# EAGLE design scheme1 (EAGLE 7.1.0)
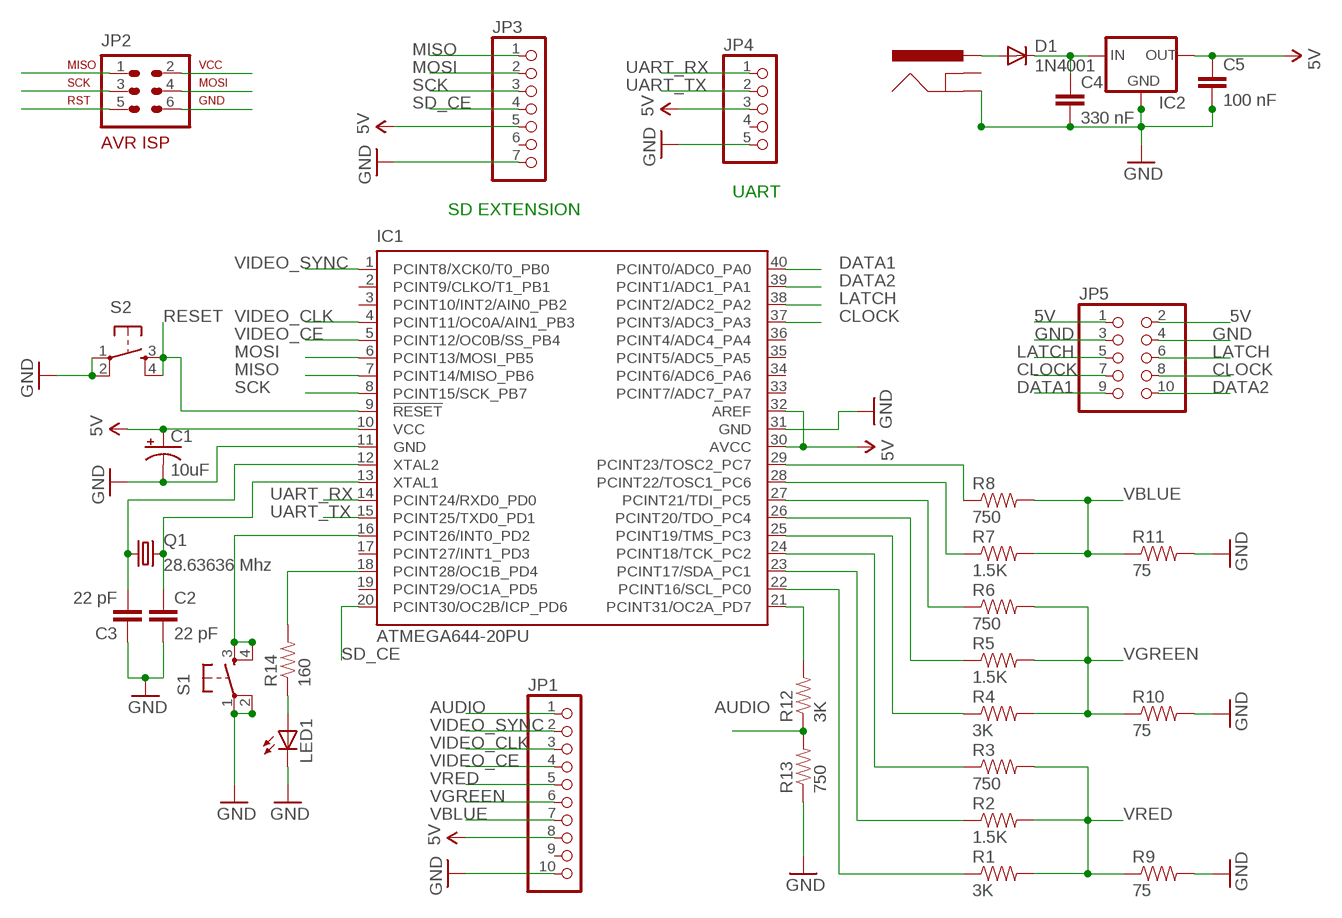
[diagram p0: schematic, sheet 1]

## Parts
C1  10uF  CAP_POLPTH2  [CPOL-RADIAL-10UF-25V]
C2  22 pF  CAPPTH  [CAP-PTH-SMALL]
C3  22 pF  CAPPTH  [CAP-PTH-SMALL]
C4  330 nF  CAPPTH  [CAP-PTH-SMALL]
C5  100 nF  CAPPTH  [CAP-PTH-SMALL]
D1  1N4001  DIODEPTH  [DIODE-1N4001]
IC1  ATMEGA644-20PU  [DIL40]
IC2  V_REG_78XXSIDE  [78XXL]
J1  POWER_JACKSLT  [POWER_JACK_SLOT]
JP1  PINHD-1X10  [1X10]
JP2  AVR-ISP-6VERT  [AVR-ISP-6]
JP3  PINHD-1X7  [1X07]
JP4  PINHD-1X5  [1X05]
JP5  PINHD-2X5  [2X05]
LED1  LED3MM  [LED3MM]
Q1  28.63636 Mhz  CRYSTALHC49US  [HC49US]
R1  3K  RESISTORPTH1  [AXIAL-0.3]
R2  1.5K  RESISTORPTH1  [AXIAL-0.3]
R3  750  RESISTORPTH1  [AXIAL-0.3]
R4  3K  RESISTORPTH1  [AXIAL-0.3]
R5  1.5K  RESISTORPTH1  [AXIAL-0.3]
R6  750  RESISTORPTH1  [AXIAL-0.3]
R7  1.5K  RESISTORPTH1  [AXIAL-0.3]
R8  750  RESISTORPTH1  [AXIAL-0.3]
R9  75  RESISTORPTH1  [AXIAL-0.3]
R10  75  RESISTORPTH1  [AXIAL-0.3]
R11  75  RESISTORPTH1  [AXIAL-0.3]
R12  3K  RESISTORPTH1  [AXIAL-0.3]
R13  750  RESISTORPTH1  [AXIAL-0.3]
R14  160  RESISTORPTH1  [AXIAL-0.3]
S1  TAC_SWITCHPTH  [TACTILE-PTH]
S2  TAC_SWITCHPTH  [TACTILE-PTH]

## Nets
5V: C1.1(+) C5.1 IC1.10(VCC) IC1.30(AVCC) IC1.32(AREF) IC2.OUT JP1.8 JP2.2 JP3.5 JP4.3 JP5.1 JP5.2
AUDIO: JP1.1 R12.P$1 R13.P$2
CLOCK: IC1.37(PCINT3/ADC3_PA3) JP5.7 JP5.8
DATA1: IC1.40(PCINT0/ADC0_PA0) JP5.9
DATA2: IC1.39(PCINT1/ADC1_PA1) JP5.10
GND: C1.2(-) C2.2 C3.1 C4.2 C5.2 IC1.11(GND) IC1.31(GND) IC2.GND J1.GND@2(GND) JP1.10 JP2.6 JP3.7 JP4.5 JP5.3 JP5.4 LED1.K(C) R9.P$2 R10.P$2 R11.P$2 R13.P$1 S1.1 S1.2 S2.1 S2.2
LATCH: IC1.38(PCINT2/ADC2_PA2) JP5.5 JP5.6
MISO: IC1.7(PCINT14/MISO_PB6) JP2.1 JP3.1
MOSI: IC1.6(PCINT13/MOSI_PB5) JP2.4 JP3.2
N$1: IC1.22(PCINT16/SCL_PC0) R1.P$1
N$2: IC1.23(PCINT17/SDA_PC1) R2.P$1
N$3: IC1.24(PCINT18/TCK_PC2) R3.P$1
N$4: C3.2 IC1.12(XTAL2) Q1.1
N$5: C2.1 IC1.13(XTAL1) Q1.2
N$6: IC1.25(PCINT19/TMS_PC3) R4.P$1
N$7: IC1.26(PCINT20/TDO_PC4) R5.P$1
N$8: IC1.27(PCINT21/TDI_PC5) R6.P$1
N$9: IC1.28(PCINT22/TOSC1_PC6) R7.P$1
N$10: IC1.29(PCINT23/TOSC2_PC7) R8.P$1
N$11: IC1.21(PCINT31/OC2A_PD7) R12.P$2
N$12: IC1.18(PCINT28/OC1B_PD4) R14.P$2
N$13: LED1.A R14.P$1
N$14: IC1.16(PCINT26/INT0_PD2) S1.3 S1.4
N$15: D1.A J1.PWR
N$16: C4.1 D1.C IC2.IN
RESET: IC1.9(!RESET) JP2.5 S2.3 S2.4
SCK: IC1.8(PCINT15/SCK_PB7) JP2.3 JP3.3
SD_CE: IC1.20(PCINT30/OC2B/ICP_PD6) JP3.4
UART_RX: IC1.14(PCINT24/RXD0_PD0) JP4.1
UART_TX: IC1.15(PCINT25/TXD0_PD1) JP4.2
VBLUE: JP1.7 R7.P$2 R8.P$2 R11.P$1
VGREEN: JP1.6 R4.P$2 R5.P$2 R6.P$2 R10.P$1
VIDEO_CE: IC1.5(PCINT12/OC0B/SS_PB4) JP1.4
VIDEO_CLK: IC1.4(PCINT11/OC0A/AIN1_PB3) JP1.3
VIDEO_SYNC: IC1.1(PCINT8/XCK0/T0_PB0) JP1.2
VRED: JP1.5 R1.P$2 R2.P$2 R3.P$2 R9.P$1
Unconnected: IC1.2(PCINT9/CLKO/T1_PB1) IC1.3(PCINT10/INT2/AIN0_PB2) IC1.17(PCINT27/INT1_PD3) IC1.19(PCINT29/OC1A_PD5) IC1.33(PCINT7/ADC7_PA7) IC1.34(PCINT6/ADC6_PA6) IC1.35(PCINT5/ADC5_PA5) IC1.36(PCINT4/ADC4_PA4) J1.GND@1(GNDBREAK) JP1.9 JP3.6 JP4.4

## Notes on the sheet
- UART
- SD EXTENSION

## Library data of the parts
C1 = SparkFun:CAP_POL: Capacitor Polarized These are standard SMD and PTH capacitors. Normally 10uF, 47uF, and 100uF in electrolytic and tantalum varieties. Always verify the external diameter of the through hole cap, it varies with capacity, voltage, and manufacturer. The EIA devices should be standard.
C2-C5 = SparkFun:CAP: Capacitor Standard 0603 ceramic capacitor, and 0.1" leaded capacitor.
D1 = SparkFun:DIODE: Diode These are standard reverse protection diodes and small signal diodes. SMA package can handle up to about 1A. SOD-323 can handle about 200mA. What the SOD-323 package when ordering, there are some mfgs out there that are 5-pin packages.
IC1 = atmel:ATMEGA644-*PU: 8-bit Microcontroller with 64K Bytes In-System Programmable Flash Auto generated by make-symbol-device-package-bsdl.ulp Rev. 34 Source: http://www.atmel.com/dyn/resources/prod_documents/doc2593.pdf; MPN: ATMEGA644-20PU; OC_FARNELL: 1288340; OC_NEWARK: 23M5060
IC2 = SparkFun:V_REG_78XX: Voltage Regulator Standard 7805 5V regulator. IGO (Input Ground Output). Spark Fun Electronics SKU : COM-00107
J1 = SparkFun:POWER_JACK: Power Jack This is the standard 5.5mm barrel jack for power. The PTH is the most common, proven, reliable, footprint. All others are experimental. The Slot footprint only works if the mill layer is transmitted to the PCB fab house so be warned. Spark Fun Electronics SKU : PRT-00119. Mating wall wart : TOL-00298 (and others)
JP1 = pinhead:PINHD-1X10: PIN HEADER
JP2 = avr-7:AVR-ISP-6: AVR ISP-6 Serial Programming Header
JP3 = pinhead:PINHD-1X7: PIN HEADER
JP4 = pinhead:PINHD-1X5: PIN HEADER
JP5 = pinhead:PINHD-2X5: PIN HEADER
LED1 = SparkFun:LED: LEDs Standard schematic elements and footprints for 5mm, 3mm, 1206, and 0603 sized LEDs. 5mm - Spark Fun Electronics SKU : COM-00529 (and others)
Q1 = SparkFun:CRYSTAL: Crystals Various standard crystals. Proven footprints. Spark Fun Electronics SKU : COM-00534
R1-R14 = SparkFun:RESISTOR: Resistor Basic schematic elements and footprints for 0603, 1206, and PTH 1/10th watt (small) resistors.
S1 S2 = SparkFun:TAC_SWITCH: Momentary Switch Button commonly used for reset or general input. Spark Fun Electronics SKU : COM-00097

## Board
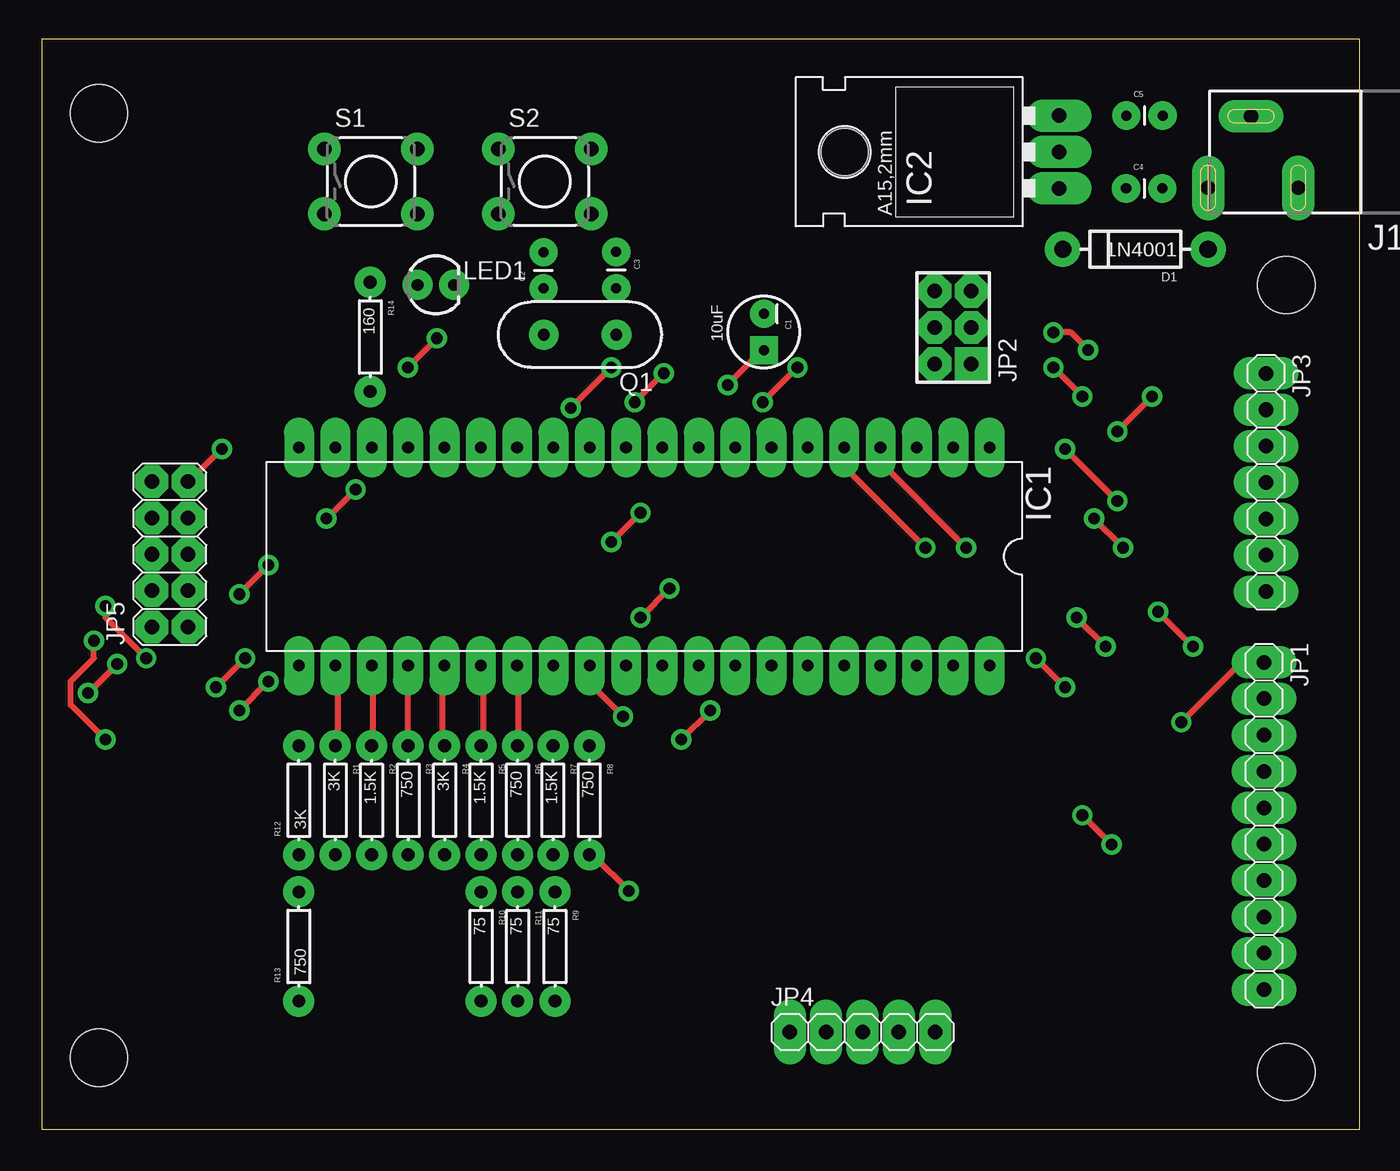
[diagram p1: board, top side]
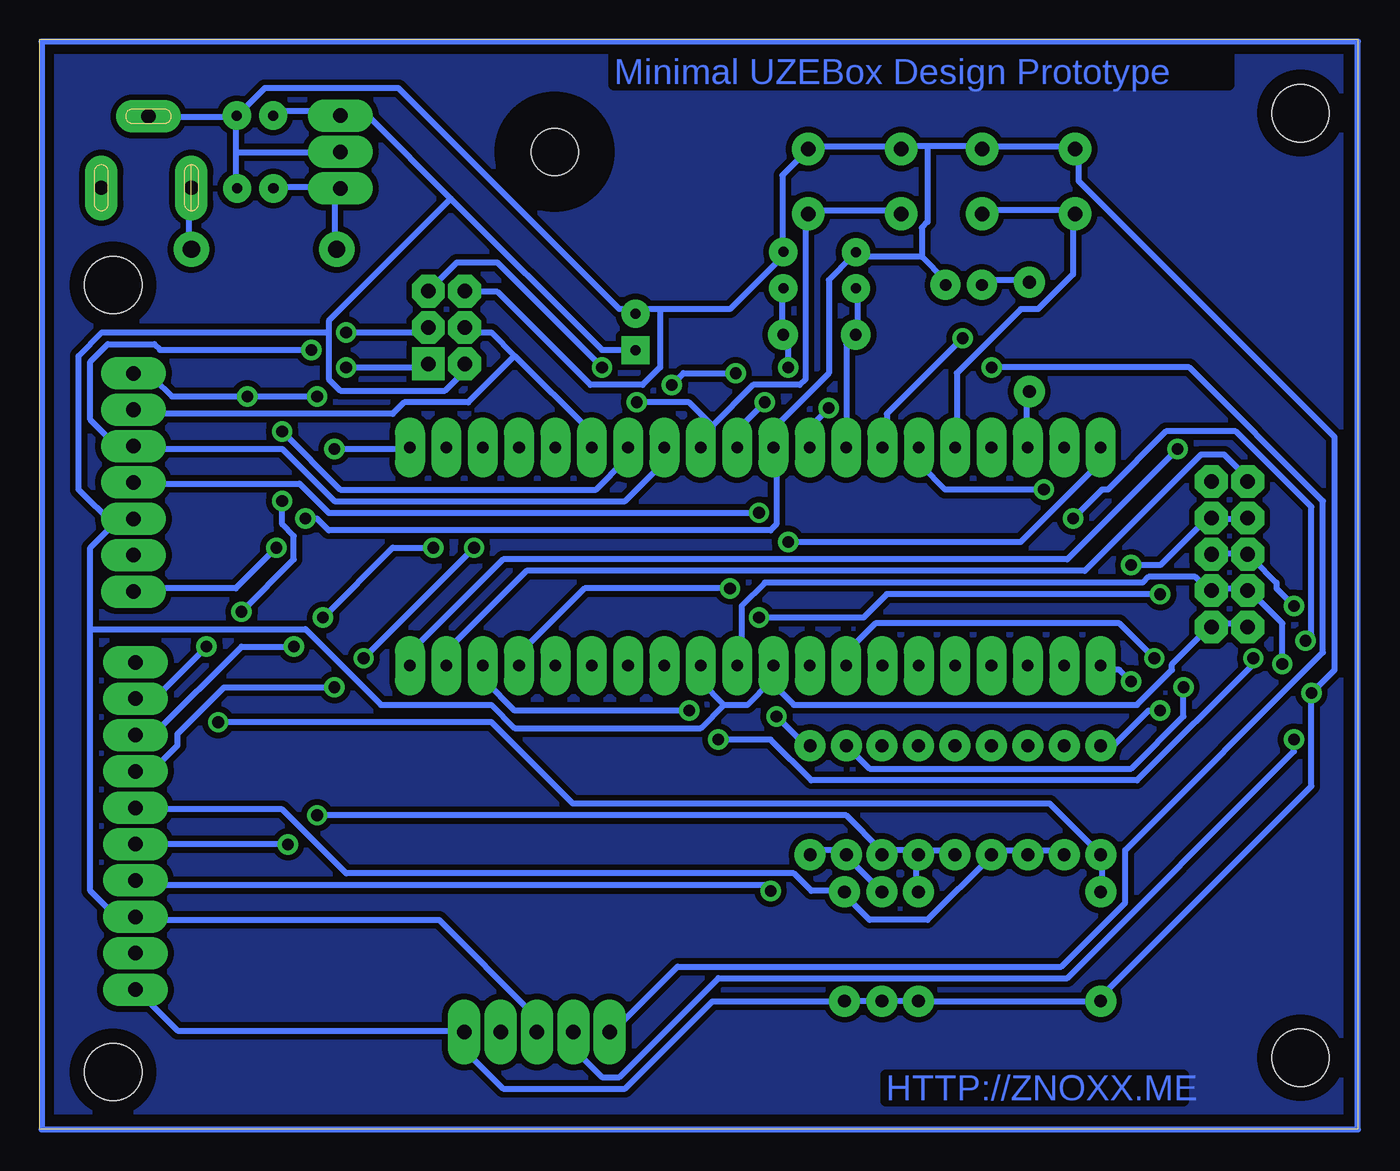
[diagram p2: board, bottom side, seen from below]

Size 92.12 x 76.16 mm. Coordinates in mm from the lower left corner, seen from the top.
Outline: 0,0 92.12,0 92.12,76.16 0,76.16 0,0
Copper layers (1*16): Top 0.035mm / dielectric 1.5mm / Bottom 0.035mm
Design rules "default *": minimum track width 16mil, minimum drill 32mil, track to track 16mil, track to pad 12mil, pad to pad 12mil, via to via 12mil, smd to smd 8mil, copper to edge 40mil, drill to drill 40mil, minimum pad ring 25mil, minimum via ring 12mil, stop-mask expansion 4mil, vias tented up to drill 0mil, thermal gap 10mil
Holes 4 mm at 4,5 4,71 87,59 87,4

### Footprints (pad centres in the part's own frame; a part is rotated, then mirrored left to right if it is on the bottom)
CPOL-RADIAL-10UF-25V = drill 0.7 square: 1 1.27,0 | drill 0.7: 2 -1.27,0
CAP-PTH-SMALL = drill 0.7: 1 0,0; 2 2.54,0
DIODE-1N4001 = drill 1.2: A -5.08,0; C 5.08,0
DIL40 = drill 0.813 long: 1 -24.13,-7.62; 2 -21.59,-7.62; 3 -19.05,-7.62; 4 -16.51,-7.62; 5 -13.97,-7.62; 6 -11.43,-7.62; 7 -8.89,-7.62; 8 -6.35,-7.62; 9 -3.81,-7.62; 10 -1.27,-7.62; 11 1.27,-7.62; 12 3.81,-7.62; 13 6.35,-7.62; 14 8.89,-7.62; 15 11.43,-7.62; 16 13.97,-7.62; 17 16.51,-7.62; 18 19.05,-7.62; 19 21.59,-7.62; 20 24.13,-7.62; 21 24.13,7.62; 22 21.59,7.62; 23 19.05,7.62; 24 16.51,7.62; 25 13.97,7.62; 26 11.43,7.62; 27 8.89,7.62; 28 6.35,7.62; 29 3.81,7.62; 30 1.27,7.62; 31 -1.27,7.62; 32 -3.81,7.62; 33 -6.35,7.62; 34 -8.89,7.62; 35 -11.43,7.62; 36 -13.97,7.62; 37 -16.51,7.62; 38 -19.05,7.62; 39 -21.59,7.62; 40 -24.13,7.62
78XXL = drill 1.016 long: GND 0,-3.81; IN -2.54,-3.81; OUT 2.54,-3.81 | hole 3.302: 0,11.176
POWER_JACK_SLOT = drill 1 pad 2 long: GND@1 2.58,7.5; GND@2 7.58,10.8; PWR 2.58,13.8
1X10 = drill 1.016 long: 1 -11.43,0; 2 -8.89,0; 3 -6.35,0; 4 -3.81,0; 5 -1.27,0; 6 1.27,0; 7 3.81,0; 8 6.35,0; 9 8.89,0; 10 11.43,0
AVR-ISP-6 = drill 1.016 square: 1 -2.54,-1.27 | drill 1.016 octagon: 2 -2.54,1.27; 3 0,-1.27; 4 0,1.27; 5 2.54,-1.27; 6 2.54,1.27
1X07 = drill 1.016 long: 1 -7.62,0; 2 -5.08,0; 3 -2.54,0; 4 0,0; 5 2.54,0; 6 5.08,0; 7 7.62,0
1X05 = drill 1.016 long: 1 -5.08,0; 2 -2.54,0; 3 0,0; 4 2.54,0; 5 5.08,0
2X05 = drill 1.016 octagon: 1 -5.08,-1.27; 2 -5.08,1.27; 3 -2.54,-1.27; 4 -2.54,1.27; 5 0,-1.27; 6 0,1.27; 7 2.54,-1.27; 8 2.54,1.27; 9 5.08,-1.27; 10 5.08,1.27
LED3MM = drill 0.813: A -1.27,0; K 1.27,0
HC49US = drill 0.813: 1 -2.54,0; 2 2.54,0
AXIAL-0.3 = drill 0.9: P$1 -3.81,0; P$2 3.81,0
TACTILE-PTH = drill 1.016: 1 -3.251,2.261; 2 3.251,2.261; 3 -3.251,-2.261; 4 3.251,-2.261

### Placement (x,y rotation side)
C1  50.48,55.71 270 top
C2  35.08,58.75 90 top
C3  40.16,61.3 270 top
C4  75.8,65.74 0 top
C5  75.81,70.83 0 top
D1  76.45,61.5 180 top
IC1  42.12,40.02 180 top
IC2  67.31,68.29 90 top
J1  95.33,63.2 90 top
JP1  85.45,21.2 270 top
JP2  63.7,56.03 90 top
JP3  85.59,45.2 270 top
JP4  57.38,6.8 0 top
JP5  8.97,40.18 90 top
LED1  27.55,59 0 top
Q1  37.64,55.52 180 top
R1  20.53,23 270 top
R2  23.07,23 270 top
R3  25.63,23 270 top
R4  28.18,23 270 top
R5  30.72,23 270 top
R6  33.27,23 270 top
R7  35.74,23 270 top
R8  38.28,23 270 top
R9  35.88,12.78 270 top
R10  30.72,12.78 270 top
R11  33.27,12.78 270 top
R12  17.98,23 90 top
R13  17.98,12.78 90 top
R14  22.97,55.37 270 top
S1  23.01,66.23 0 top
S2  35.17,66.23 0 top

### Tracks (layer width: path | path; a pad name or v marks a point on that pad's centre or on a via)
5V  (via drill 0.81)
  Top 0.406: v43.49,52.83 v41.45,50.8 | v47.96,52.02 50.39,54.46 C1.1
  Bottom 0.406: 63.4,65.02 69.09,70.71 71.12,70.71 IC2.OUT 71.53,71.12 75.59,71.12 C5.1 | 63.4,65.02 52.83,54.46 50.8,54.46 C1.1 | v41.45,50.8 43.08,49.17 43.08,47.95 IC1.10 | v43.49,52.83 47.14,52.83 v47.96,52.02 | 71.93,55.68 71.93,56.49 63.4,65.02 | 71.93,55.68 71.93,52.43 71.12,51.61 63.81,51.61 62.59,52.83 62.59,53.24 JP2.2 | JP5.2 7.72,35.36 10.16,35.36 JP5.1 10.57,34.95 13.01,32.51 13.01,32.11 15.44,29.67 39.42,29.67 41.05,31.29 | 41.05,31.29 41.05,32.11 IC1.30 41.05,31.29 | 41.05,31.29 42.67,29.67 44.3,29.67 | 44.3,29.67 45.92,31.29 45.92,32.11 IC1.32 | JP4.3 57.71,6.91 57.71,8.13 64.21,14.63 85.34,14.63 JP1.8 85.75,15.04 86.97,15.04 88.6,16.66 88.6,34.95 | 86.97,42.27 85.75,42.27 JP3.5 86.97,42.27 | 86.97,42.27 88.6,40.64 88.6,34.95 | 44.3,29.67 45.92,28.04 58.93,28.04 60.55,29.67 68.28,29.67 73.56,34.95 88.6,34.95 | 71.93,55.68 87.78,55.68 89.41,54.05 89.41,44.7 86.97,42.27
AUDIO  (via drill 0.81)
  Top 0.406: v79.65,28.45 83.72,32.51 85.34,32.51 JP1.1
  Bottom 0.406: R13.P$2 17.88,16.66 17.88,19.1 R12.P$1 18.29,19.51 21.54,22.76 54.86,22.76 60.55,28.45 v79.65,28.45
CLOCK  (via drill 0.81)
  Top 0.406: v41.86,35.76 v43.89,37.8 | v15.85,39.42 v13.82,37.39
  Bottom 0.406: v43.89,37.8 54.05,37.8 58.52,33.33 58.52,32.51 IC1.37 | v41.86,35.76 34.54,35.76 32.92,37.39 v13.82,37.39 | v15.85,39.42 13.82,39.42 10.57,42.67 JP5.7 10.16,42.67 7.72,42.67 JP5.8
DATA1  (via drill 0.81)
  Top 0.406: v12.6,47.55 10.57,45.52 JP5.9
  Bottom 0.406: v12.6,47.55 20.32,39.83 59.74,39.83 66.24,33.33 66.24,32.51 IC1.40
DATA2
  Bottom 0.406: IC1.39 63.4,32.51 63.4,33.73 58.12,39.01 19.1,39.01 10.97,47.14 9.35,47.14 7.72,45.52 JP5.10
GND  (via drill 0.81)
  Top 0.406: v73.56,42.67 v75.59,40.64 | v3.25,30.48 v5.28,32.51
  Bottom 0.406: 30.48,60.96 34.95,60.96 C2.2 35.36,60.96 36.98,59.33 36.98,52.83 40.64,49.17 40.64,47.95 IC1.11 40.64,47.55 40.64,42.27 41.05,41.86 71.93,41.86 72.75,42.67 v73.56,42.67 | 30.48,60.96 28.85,59.33 LED1.K | v75.59,40.64 78.44,37.8 85.34,37.8 JP3.7 | 78.44,70.71 78.44,68.28 | 78.44,68.28 78.44,65.84 C4.2 | 78.44,70.71 84.13,70.71 J1.GND@2 | 78.44,70.71 C5.2 78.03,71.12 76.4,72.75 67.06,72.75 51.61,57.3 50.8,57.3 C1.2 50.39,57.3 48.77,57.3 | 78.44,68.28 71.53,68.28 IC2.GND | 30.07,68.68 26.42,68.68 S1.2 26.01,68.68 19.91,68.68 S1.1 19.51,68.28 19.51,66.24 1.63,48.36 1.63,32.11 v3.25,30.48 3.25,23.98 17.88,9.35 R13.P$1 18.29,8.94 30.48,8.94 R10.P$2 30.89,8.94 32.92,8.94 R11.P$2 33.33,8.94 35.76,8.94 R9.P$2 36.17,8.94 45.11,8.94 51.21,2.85 59.74,2.85 62.18,5.28 62.18,6.5 JP4.5 62.59,6.91 82.5,6.91 85.34,9.75 JP1.10 | 30.07,68.68 31.7,68.68 S2.1 32.11,68.68 38.2,68.68 S2.2 38.61,68.28 40.23,66.65 40.23,61.37 C3.1 40.23,60.96 43.89,57.3 48.77,57.3 | 48.77,57.3 48.77,53.24 49.99,52.02 53.65,52.02 60.15,58.52 62.18,58.52 JP2.6 | 30.48,60.96 30.48,62.99 30.07,63.4 30.07,68.68 | IC1.31 43.08,32.51 43.08,36.58 41.45,38.2 15.04,38.2 14.63,38.61 11.38,38.61 10.57,37.8 JP5.3 10.16,37.8 7.72,37.8 JP5.4 7.32,37.39 5.28,35.36 v5.28,32.51
LATCH  (via drill 0.81)
  Top 0.406: v44.7,27.23 v46.74,29.26 | v7.32,32.92 4.47,35.76 v4.47,36.58
  Bottom 0.406: v46.74,29.26 58.93,29.26 60.96,31.29 60.96,32.11 IC1.38 | v44.7,27.23 41.05,27.23 38.2,24.38 15.44,24.38 7.32,32.51 v7.32,32.92 | v4.47,36.58 5.69,37.8 5.69,38.2 7.32,39.83 JP5.6 7.72,40.23 10.16,40.23 JP5.5
MISO  (via drill 0.81)
  Top 0.406: v77.62,51.21 v75.18,48.77 | v72.75,51.21 v70.71,53.24
  Bottom 0.406: v75.18,48.77 71.12,44.7 53.24,44.7 51.21,46.74 51.21,47.55 IC1.7 | JP3.1 85.34,52.43 84.13,52.43 82.91,51.21 v77.62,51.21 v72.75,51.21 | v70.71,53.24 65.02,53.24 JP2.1
MOSI
  Bottom 0.406: 58.93,54.05 60.55,55.68 62.18,55.68 JP2.4 | 58.93,54.05 53.65,48.77 53.65,47.95 IC1.6 | 58.93,54.05 62.18,50.8 66.65,50.8 67.46,49.99 85.34,49.99 JP3.2
N$1
  Top 0.406: IC1.22 20.73,32.11 20.73,26.82 R1.P$1
N$2
  Top 0.406: IC1.23 23.17,32.11 23.17,26.82 R2.P$1
N$3
  Top 0.406: IC1.24 25.6,32.11 25.6,26.82 R3.P$1
N$4  (via drill 0.81)
  Top 0.406: v39.83,53.24 v36.98,50.39
  Bottom 0.406: C3.2 40.23,58.52 40.23,55.68 Q1.1 39.83,55.27 v39.83,53.24 | v36.98,50.39 38.2,49.17 38.2,47.95 IC1.12
N$5
  Bottom 0.406: C2.1 34.95,58.52 34.95,55.68 Q1.2 35.36,55.27 35.76,54.86 35.76,47.95 IC1.13
N$6
  Top 0.406: IC1.25 28.04,32.11 28.04,26.82 R4.P$1
N$7
  Top 0.406: IC1.26 30.89,32.11 30.89,26.82 R5.P$1
N$8
  Top 0.406: IC1.27 33.33,32.11 33.33,26.82 R6.P$1
N$9  (via drill 0.81)
  Top 0.406: v12.19,30.89 v14.22,32.92
  Bottom 0.406: v14.22,32.92 16.66,35.36 33.73,35.36 35.76,33.33 35.76,32.51 IC1.28 | v12.19,30.89 12.19,28.85 15.85,25.2 34.14,25.2 35.36,26.42 R7.P$1
N$10  (via drill 0.81)
  Top 0.406: v40.64,28.85 38.61,30.89 38.61,32.11 IC1.29
  Bottom 0.406: v40.64,28.85 38.61,26.82 R8.P$1
N$11  (via drill 0.81)
  Top 0.406: v13.82,29.26 v15.85,31.29
  Bottom 0.406: v15.85,31.29 16.66,32.11 17.88,32.11 IC1.21 | v13.82,29.26 14.63,29.26 17.07,26.82 17.88,26.82 R12.P$2
N$12
  Bottom 0.406: IC1.18 23.17,47.95 23.17,51.21 R14.P$2
N$13
  Bottom 0.406: LED1.A 26.01,59.33 23.17,59.33 R14.P$1
N$14
  Bottom 0.406: IC1.16 28.04,47.95 28.04,52.83 23.57,57.3 22.35,57.3 19.91,59.74 19.91,63.8 S1.3 19.91,64.21 26.01,64.21 S1.4
N$15
  Bottom 0.406: J1.PWR 81.69,65.43 81.69,61.77 D1.A
N$16
  Bottom 0.406: C4.1 75.59,65.84 71.53,65.84 IC2.IN 71.53,65.43 71.53,61.77 D1.C
N$17
  Bottom 0.406: 92,0 0,0 0,76 92,76 92,0
N$18
  pour Bottom: 0,76 92,76 92,0 0,0
RESET  (via drill 0.81)
  Top 0.406: v50.39,50.8 v52.83,53.24
  Bottom 0.406: 45.11,49.17 45.11,48.77 45.92,47.95 IC1.9 45.11,49.17 | 45.11,49.17 42.27,52.02 39.01,52.02 38.61,52.43 38.61,63.8 S2.4 38.2,64.21 32.11,64.21 S2.3 | v52.83,53.24 60.15,60.55 62.99,60.55 64.62,58.93 JP2.5 | v50.39,50.8 46.74,50.8 45.11,49.17
SCK  (via drill 0.81)
  Top 0.406: v70.71,55.68 71.93,55.68 v73.15,54.46
  Bottom 0.406: IC1.8 48.77,47.55 48.77,46.33 51.21,43.89 71.53,43.89 75.18,47.55 85.34,47.55 JP3.3 85.75,47.95 86.97,47.95 88.6,49.58 88.6,53.65 87.38,54.86 84.13,54.86 83.72,54.46 v73.15,54.46 | v70.71,55.68 65.02,55.68 JP2.3
SD_CE  (via drill 0.81)
  Top 0.406: v41.86,43.08 v39.83,41.05
  Bottom 0.406: v39.83,41.05 23.57,41.05 18.29,46.33 18.29,47.55 IC1.20 | v41.86,43.08 71.93,43.08 73.97,45.11 85.34,45.11 JP3.4
UART_RX  (via drill 0.81)
  Top 0.406: v25.6,53.24 v27.64,55.27
  Bottom 0.406: v27.64,55.27 32.92,49.99 32.92,47.95 IC1.14 | v25.6,53.24 11.79,53.24 2.44,43.89 2.44,33.33 16.26,19.51 16.26,15.85 20.73,11.38 47.55,11.38 52.02,6.91 JP4.1
UART_TX  (via drill 0.81)
  Top 0.406: v19.91,42.67 v21.95,44.7 | v3.66,34.14 3.66,32.92 2.03,31.29 2.03,29.67 v4.47,27.23
  Bottom 0.406: v21.95,44.7 28.85,44.7 30.48,46.33 30.48,47.55 IC1.15 | v19.91,42.67 17.88,44.7 17.48,44.7 13.41,48.77 8.53,48.77 3.25,43.48 3.25,34.54 v3.66,34.14 | v4.47,27.23 4.47,26.42 20.32,10.57 44.7,10.57 51.61,3.66 52.83,3.66 54.46,5.28 54.46,6.5 JP4.2
VBLUE  (via drill 0.81)
  Top 0.406: v41.05,16.66 38.61,19.1 R8.P$2
  Bottom 0.406: R11.P$1 33.33,16.66 35.76,19.1 R7.P$2 35.76,19.51 38.2,19.51 R8.P$2 | v41.05,16.66 41.45,17.07 85.34,17.07 JP1.7
VGREEN  (via drill 0.81)
  Top 0.406: v72.75,21.95 v74.78,19.91
  Bottom 0.406: R4.P$2 28.45,19.51 30.48,19.51 R5.P$2 | R10.P$1 30.89,16.66 30.89,19.1 R5.P$2 | R5.P$2 30.89,19.51 32.92,19.51 R6.P$2 33.33,19.51 35.76,21.95 v72.75,21.95 | v74.78,19.91 85.34,19.91 JP1.6
VIDEO_CE  (via drill 0.81)
  Top 0.406: v61.77,40.64 56.49,45.92 56.49,47.55 IC1.5 | v71.53,30.89 v69.49,32.92
  Bottom 0.406: v69.49,32.92 v61.77,40.64 | v71.53,30.89 79.25,30.89 82.5,27.64 82.5,26.82 84.13,25.2 85.34,25.2 JP1.4
VIDEO_CLK  (via drill 0.81)
  Top 0.406: v64.62,40.64 58.93,46.33 58.93,47.55 IC1.4 | v74.37,33.73 v72.34,35.76
  Bottom 0.406: v64.62,40.64 67.46,40.64 v72.34,35.76 | v74.37,33.73 78.03,33.73 84.13,27.64 85.34,27.64 JP1.3
VIDEO_SYNC  (via drill 0.81)
  Top 0.406: v75.18,43.89 v71.53,47.55 | v80.47,33.73 v78.03,36.17
  Bottom 0.406: v71.53,47.55 66.65,47.55 IC1.1 | v75.18,43.89 75.18,42.27 74.37,41.45 74.37,39.83 v78.03,36.17 | v80.47,33.73 83.72,30.48 85.34,30.48 JP1.2
VRED
  Bottom 0.406: R1.P$2 20.73,19.51 22.76,19.51 R2.P$2 23.17,19.51 25.6,19.51 R3.P$2 25.6,19.1 30.07,14.63 34.14,14.63 35.76,16.26 R9.P$1 36.17,16.66 38.2,16.66 39.42,17.88 70.71,17.88 75.18,22.35 85.34,22.35 JP1.5

### Text on the board
Bottom: Minimal UZEBox Design Prototype | HTTP://ZNOXX.ME